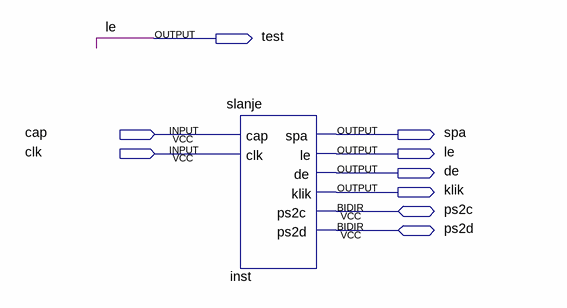
[diagram p0: schematic sheet]
// Quartus schematic test.bdf as structural Verilog: 1 symbols, 9 pins
module test (
  input  cap,
  input  clk,
  inout  ps2c,
  inout  ps2d,
  output test,
  output spa,
  output le,
  output de,
  output klik
);

  slanje inst (.cap(cap), .clk(clk), .spa(spa), .le(le), .de(de), .klik(klik), .ps2c(ps2c), .ps2d(ps2d));

  assign test = le;
endmodule
